# EAGLE design Zio Qwiic RGB LED (EAGLE 9.1.1)
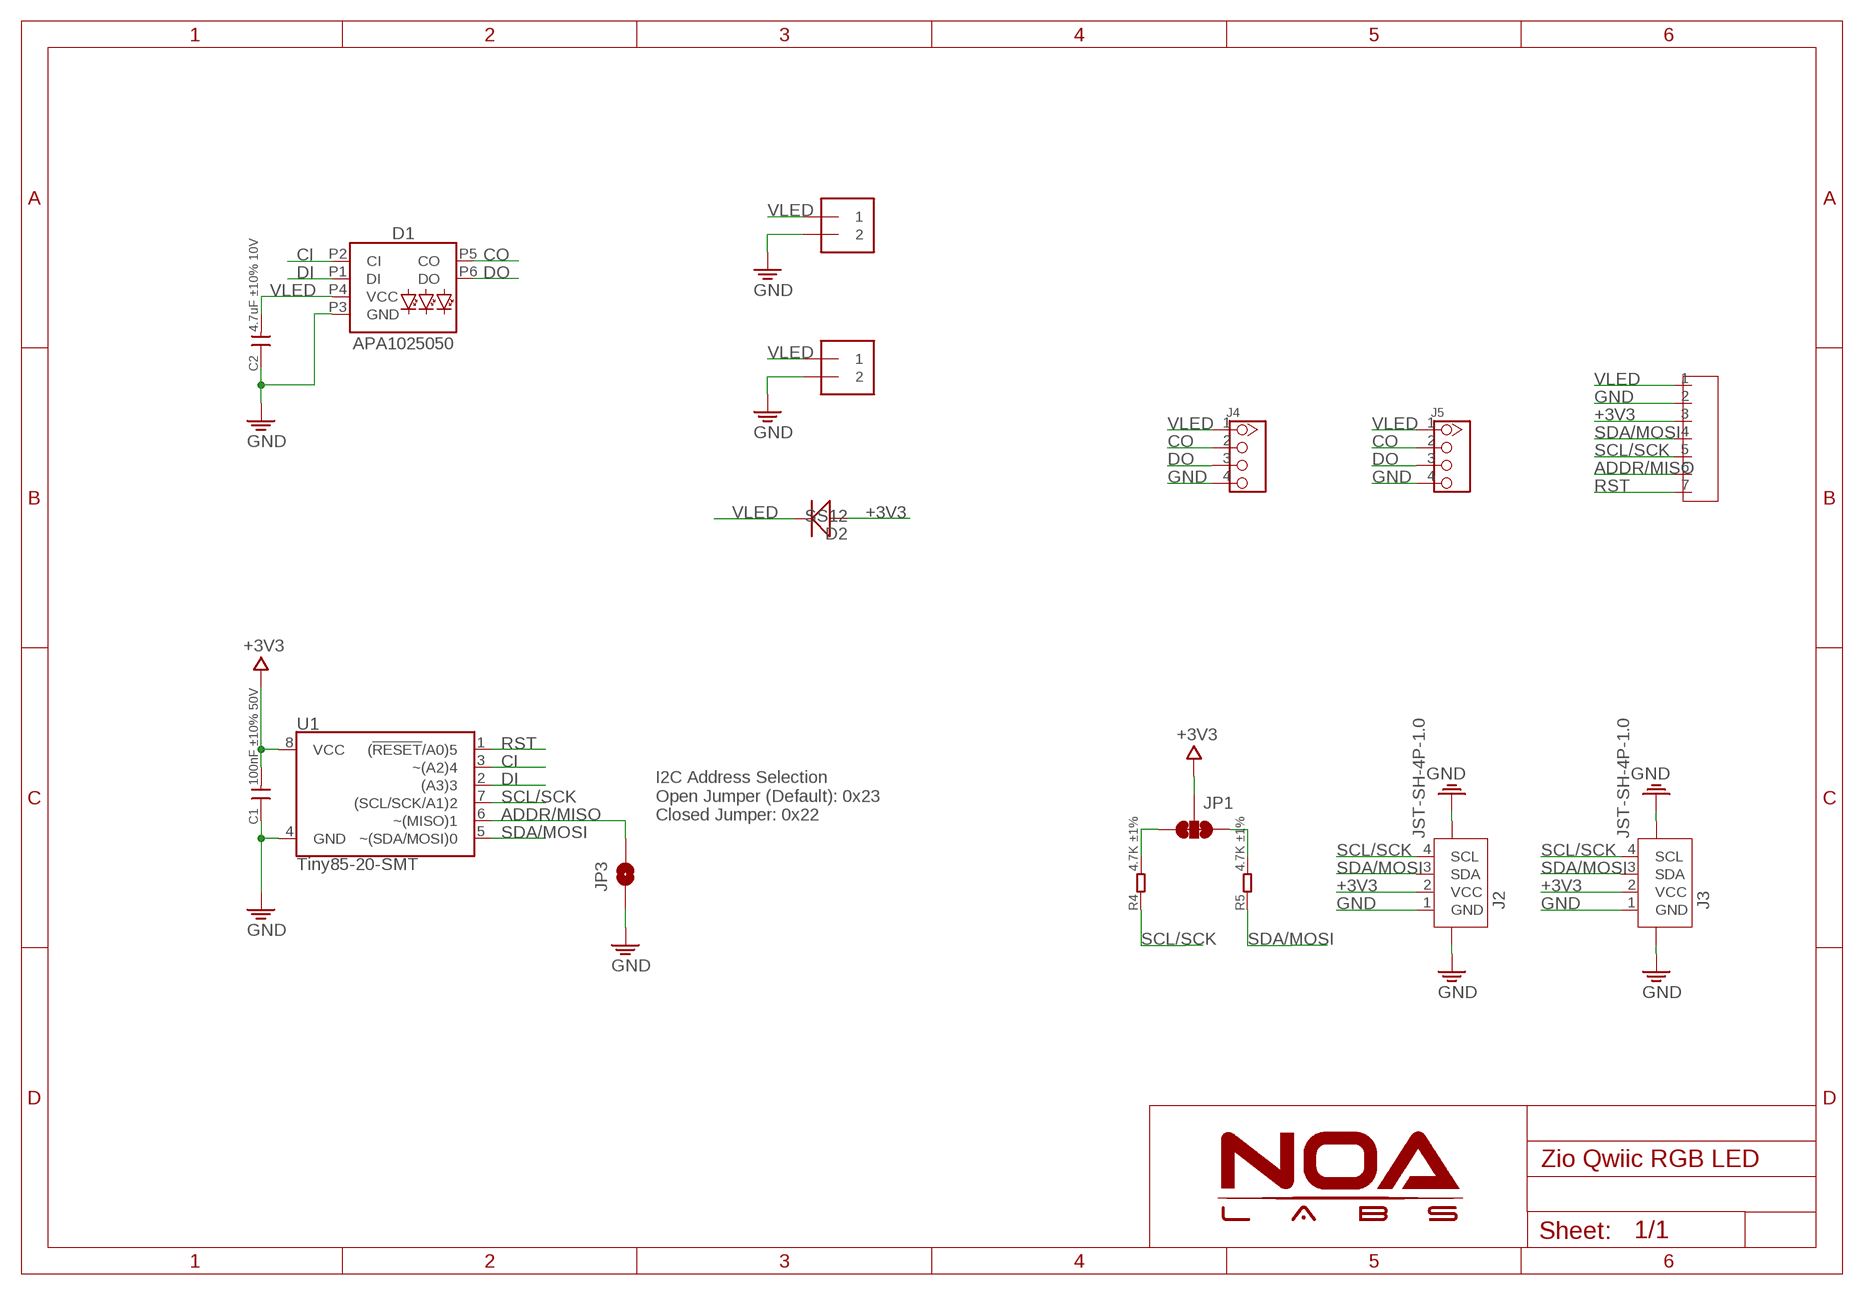
[diagram p0: schematic, sheet 1]

## Parts
C1  100nF ±10% 50V  C-0402  [C0402]
C2  4.7uF ±10% 10V  C-0603  [C0603]
D1  APA1025050  [APA102-5050]
D2  SS12  D214AA  [DO-214AC]
J1  HEADER-7P-2.54  [7P-2.54-65/35MIL]
J2  JST-SH-4P-1.0  [JST-SH-4P]
J3  JST-SH-4P-1.0  [JST-SH-4P]
J4  HEADER-4P-2.54-M  [4P-2.54-SMD-M]
J5  HEADER-4P-60/35MIL  [4P-65/35MIL]
J6  TERMBLOCK_1X2-3.5MM  [1X2-3.5MM]
J7  TERMBLOCK_1X2-3.5MM  [1X2-3.5MM]
JP1  SMT-JUMPER_3_2-NC_TRACE  [SMT-JUMPER_3_2-NC_TRACE]
JP3  JUMPER-SMT_2_NC_PASTE_SILK  [SMT-JUMPER_2_NC_PASTE_SILK]
R4  4.7K ±1%  R-0402  [R0402]
R5  4.7K ±1%  R-0402  [R0402]
U1  Tiny85-20-SMT  ATTINY85-ARDUINOTINY85-20-SMT  [SO08-EIAJ_MCU]

## Nets
+3V3: C1.2 D2.A(+) J1.3 J2.2(VCC) J3.2(VCC) JP1.2 U1.8(VCC)
ADDR/MISO: J1.6 JP3.2 U1.6(~(MISO)1)
CI: D1.P2(CI) U1.3(~(A2)4)
CO: D1.P5(CO) J4.2 J5.2
DI: D1.P1(DI) U1.2((A3)3)
DO: D1.P6(DO) J4.3 J5.3
GND: C1.1 C2.1 D1.P3(GND) J1.2 J2.1(GND) J2.NC1 J2.NC2 J3.1(GND) J3.NC1 J3.NC2 J4.4 J5.4 J6.2 J7.2 JP3.1 U1.4(GND)
N$6: JP1.3 R4.2
N$8: JP1.1 R5.2
RST: J1.7 U1.1((!RESET!/A0)5)
SCL/SCK: J1.5 J2.4(SCL) J3.4(SCL) R4.1 U1.7((SCL/SCK/A1)2)
SDA/MOSI: J1.4 J2.3(SDA) J3.3(SDA) R5.1 U1.5(~(SDA/MOSI)0)
VLED: C2.2 D1.P4(VCC) D2.C(-) J1.1 J4.1 J5.1 J6.1 J7.1

## Notes on the sheet
- I2C Address Selection
  Open Jumper (Default): 0x23
  Closed Jumper: 0x22

## Library data of the parts
C1 C2 = RCL:C
D1 = SparkFun-LED:APA102: APA102 Addressable RGB LED Used in manufacturing of various products at SparkFun Packages: 5050 2020 SparkFun Products: SparkFun Lumenati Boards <https://www.sparkfun.com/categories/405>; PROD_ID: DIO-13739
D2 = Discrete:D*
J1 = Connector:HEADER-7P
J2 J3 = Connector:JST-SH-4P
J4 = Connector:HEADER-4P
J5 = Connector_NOA:HEADER-4P
J6 J7 = microbuilder:TERMBLOCK_1X2: 3.5mm Terminal block http://www.ladyada.net/library/pcb/eaglelibrary.html
JP1 = NOA-Jumpers:SMT-JUMPER_3_2-NC_TRACE
JP3 = NOA-Jumpers:JUMPER-SMT_2_NC_PASTE: Normally closed solder jumper This jumper has an aperture in the stencil to allow solder paste to bridge the split in the wire so it's normally closed (NC). Wick off the solder to open the connection. Reapply solder to reclose the connection.
R4 R5 = RCL:R
U1 = Qwiic-Bluetooth-HC1x:ATTINY85-ARDUINO: Atmel 8-pin 2/4/8kB flash uC; PROD_ID: IC-09092

## Board
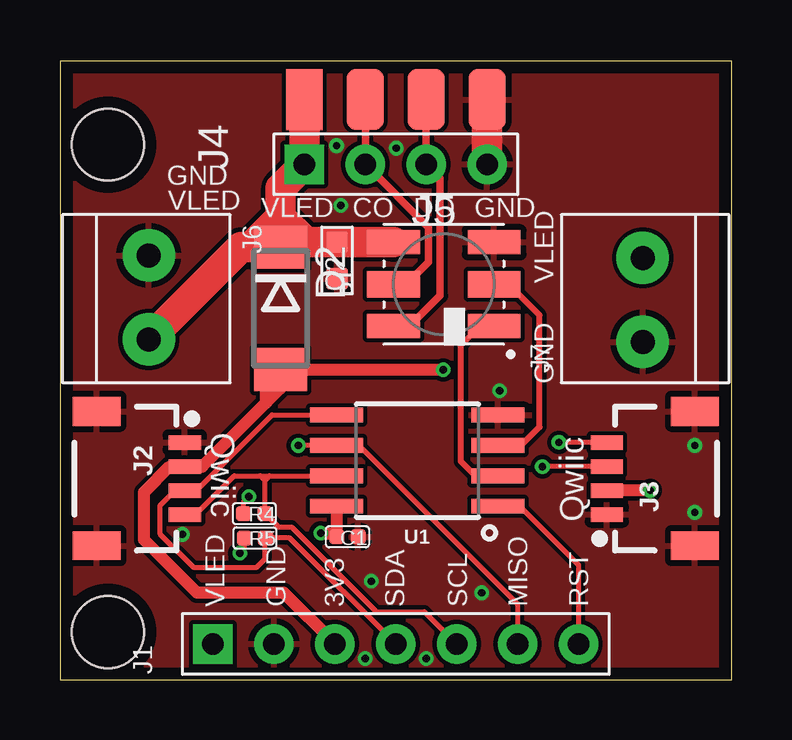
[diagram p1: board, top side]
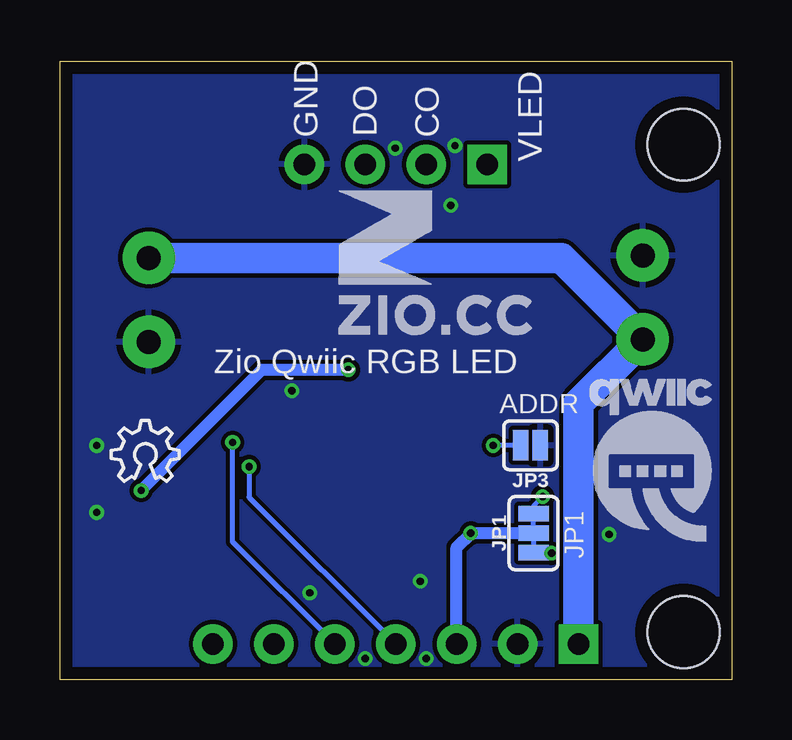
[diagram p2: board, bottom side, seen from below]

Size 28 x 25.8 mm. Coordinates in mm from the lower left corner, seen from the top.
Outline: 0,0 28,0 28,25.8 0,25.8 0,0
Copper layers (1*16): Top 0.035mm / dielectric 1.5mm / Bottom 0.035mm
Design rules "NOA Eagle Rule": minimum track width 7mil, minimum drill 12mil, track to track 7mil, track to pad 7mil, pad to pad 7mil, via to via 7mil, smd to smd 0mil, copper to edge 20mil, drill to drill 10mil, minimum pad ring 10mil, minimum via ring 6mil, stop-mask expansion 2mil, vias tented up to drill 25mil, thermal gap 10mil
Holes 3 mm at 2,2 2,22.32

### Footprints (pad centres in the part's own frame; a part is rotated, then mirrored left to right if it is on the bottom)
C0402 = smd 0.635 x 0.635: 1 -0.445,0; 2 0.445,0
C0603 = smd 0.889 x 0.889: 1 -0.762,0; 2 0.762,0
APA102-5050 = smd 1 x 2.2: P1 -1.75,-2.1; P3 1.75,-2.1; P4 1.75,2.1; P6 -1.75,2.1 | smd 1.1 x 2.2: P2 0,-2.1; P5 0,2.1
DO-214AC = smd 1.8 x 2.2: A 2.55,0; C -2.55,0
7P-2.54-65/35MIL = drill 0.889 pad 1.651 square: 1 0,7.62 | drill 0.889 pad 1.651: 2 0,5.08; 3 0,2.54; 4 0,0; 5 0,-2.54; 6 0,-5.08; 7 0,-7.62
JST-SH-4P = smd 0.6 x 1.35: 1 1.5,0; 2 0.5,0; 3 -0.5,0; 4 -1.5,0 | smd 1.2 x 2: NC1 -2.8,3.675; NC2 2.8,3.675
4P-2.54-SMD-M = smd 2.54 x 1.524: 1 0,3.81; 2 0,1.27; 3 0,-1.27; 4 0,-3.81
4P-65/35MIL = drill 0.889 pad 1.651 square: 1 0,3.81 | drill 0.889 pad 1.651: 2 0,1.27; 3 0,-1.27; 4 0,-3.81
1X2-3.5MM = drill 1 pad 2.184: 1 1.8,0; 2 -1.7,0
SMT-JUMPER_3_2-NC_TRACE = smd 0.635 x 1.27: 1 -0.813,0; 2 0,0; 3 0.813,0
SMT-JUMPER_2_NC_PASTE_SILK = smd 0.635 x 1.27: 1 -0.406,0; 2 0.406,0
R0402 = smd 0.635 x 0.635: 1 -0.445,0; 2 0.445,0
SO08-EIAJ_MCU = smd 0.61 x 2.21: 1 -1.905,-3.378; 2 -0.635,-3.378; 3 0.635,-3.378; 4 1.905,-3.378; 5 1.905,3.353; 6 0.635,3.353; 7 -0.635,3.353; 8 -1.905,3.353

### Placement (x,y rotation side)
C1  11.99,5.97 180 top
C2  11.55,17.49 90 top
D1  16,16.5 90 top
D2  9.2,15.5 270 top
J1  14,1.5 90 top
J2  5.2,8.4 90 top
J3  22.8,8.4 270 top
J4  14,24.2 90 top
J5  14,21.5 90 top
J6  3.7,16 270 top
J7  24.3,15.8 90 top
JP1  8.26,6.12 90 bottom
JP3  8.38,9.78 180 bottom
R4  8.1,6.93 180 top
R5  8.13,5.92 180 top
U1  14.89,9.14 90 top
U$1  [QWIIC-LOGO-MEDIUM]  3.38,9.22 0 bottom
U$3  [OSHW_6X100_NOTEXT]  25.86,8.28 0 bottom
U$4  [6MM]  16.41,14.4 0 bottom

### Tracks (layer width: path | path; a pad name or v marks a point on that pad's centre or on a via)
+3V3  (via drill 0.3)
  Top 0.508: v10.87,6.12 11.39,6.12 C1.2 11.54,7.23 U1.8 | 8.6,11.57 5.94,8.9 J2.2 4.58,8.9 3.5,7.82 3.5,5.84 5.71,3.63 9.33,3.63 J1.3 | 8.6,11.57 9.2,12.16 D2.A 15.96,12.95 v15.98,12.93 | v24.61,7.9 J3.2 | 8.6,11.57 8.6,12.76 | 8.6,12.76 8.59,12.78 8.6,12.76 | 8.6,12.76 8.6,11.57
  Bottom 0.508: JP1.2 v10.87,6.12 11.46,5.53 J1.3 | v15.98,12.93 19.58,12.93 v24.61,7.9
ADDR/MISO  (via drill 0.3)
  Top 0.203: J1.6 19.08,3.17 12.47,9.78 U1.6 v9.93,9.78
  Bottom 0.203: JP3.2 v9.93,9.78
CI
  Top 0.254: U1.3 19.23,9.78 19.99,10.54 19.99,15.21 18.71,16.5 D1.P2
CO
  Top 0.305: D1.P5 14.44,16.5 15.37,17.42 15.37,18.86 J5.2 J4.2
DI
  Top 0.254: U1.2 17.32,8.51 16.71,9.12 16.71,13.97 17.49,14.75 D1.P1
DO
  Top 0.203: D1.P6 14.57,14.75 14.99,15.16
  Top 0.305: J4.3 J5.3 15.85,20.92 15.85,16.03 14.99,15.16 14.57,14.75
GND  (via drill 0.3)
  Top 1.27: J5.4 J4.4
  other vias: 12.73,0.89 12.98,4.11 17.58,3.63 15.27,0.89 26.47,6.99 18.34,12.06 26.47,9.78 5.11,6.07 11.71,19.79 14.02,22.17 11.53,22.28
  pour Bottom: 0,25.81 28,25.81 28,0 0,0
  pour Top: 0,25.81 28,25.81 28,0 0,0
N$6  (via drill 0.3)
  Top 0.203: R4.2 7.66,7.43 v7.87,7.64
  Bottom 0.178: JP1.3 8.26,7.26 v7.87,7.64
N$8  (via drill 0.3)
  Top 0.203: R5.2 7.68,5.47 v7.5,5.28
  Bottom 0.178: JP1.1 8.23,5.28 v7.5,5.28
RST
  Top 0.203: U1.1 19.18,7.24 21.62,4.8 J1.7
SCL/SCK  (via drill 0.3)
  Top 0.203: J2.4 5.66,6.9 7.26,8.51 8.33,8.51 | 8.33,8.51 8.74,8.51 | 8.74,8.51 U1.7 | 8.55,8.32 R4.1 9.11,6.38 9.66,6.38 13.19,2.85 15.2,2.85 J1.5 | 8.55,8.32 8.74,8.51 | 8.55,8.32 8.36,8.51 8.33,8.51 | J3.4 v20.81,9.9
  Top 0.254: v20.81,9.9 v20.8,9.91
  Bottom 0.203: J1.5 20.8,5.76 v20.8,9.91
SDA/MOSI  (via drill 0.3)
  Top 0.203: U1.5 8.84,11.05 5.69,7.9 J2.3 4.8,7.9 4.17,7.26 4.17,6.1 5.56,4.7 8.2,4.7 8.56,5.05 8.56,5.77 8.57,5.78 R5.1 9.58,5.92 J1.4 | J3.3 v20.13,8.9
  Top 0.254: v20.13,8.9 v20.12,8.89
  Bottom 0.203: v20.12,8.89 20.12,7.62 J1.4
VLED
  Top 1.27: J4.1 J5.1 9.2,20.51 9.2,19.3 | D1.P4 C2.2 10.36,18.25 | 10.36,18.25 9.4,18.25 D2.C | D2.C 9.2,19.3 | 9.2,19.3 10.25,18.25 10.36,18.25 | J6.1 7.55,18.05 | 7.55,18.05 D2.C | 9.2,19.3 7.95,18.05 7.55,18.05
  Bottom 1.27: J7.1 7.1,17.6 5.84,16.34 4.59,15.09 J6.1 6.38,11.52 J1.1

### Text on the board
tPlace: GND | VLED | VLED | VLED | CO | DO | GND | GND | Qwiic | Qwiic | VLED | GND | 3V3 | SDA | SCL | MISO | RST
bPlace: CO | DO | GND | VLED | Zio Qwiic RGB LED | ADDR | JP1